# EAGLE design PCB-111000_V3 (EAGLE 9.6.2)
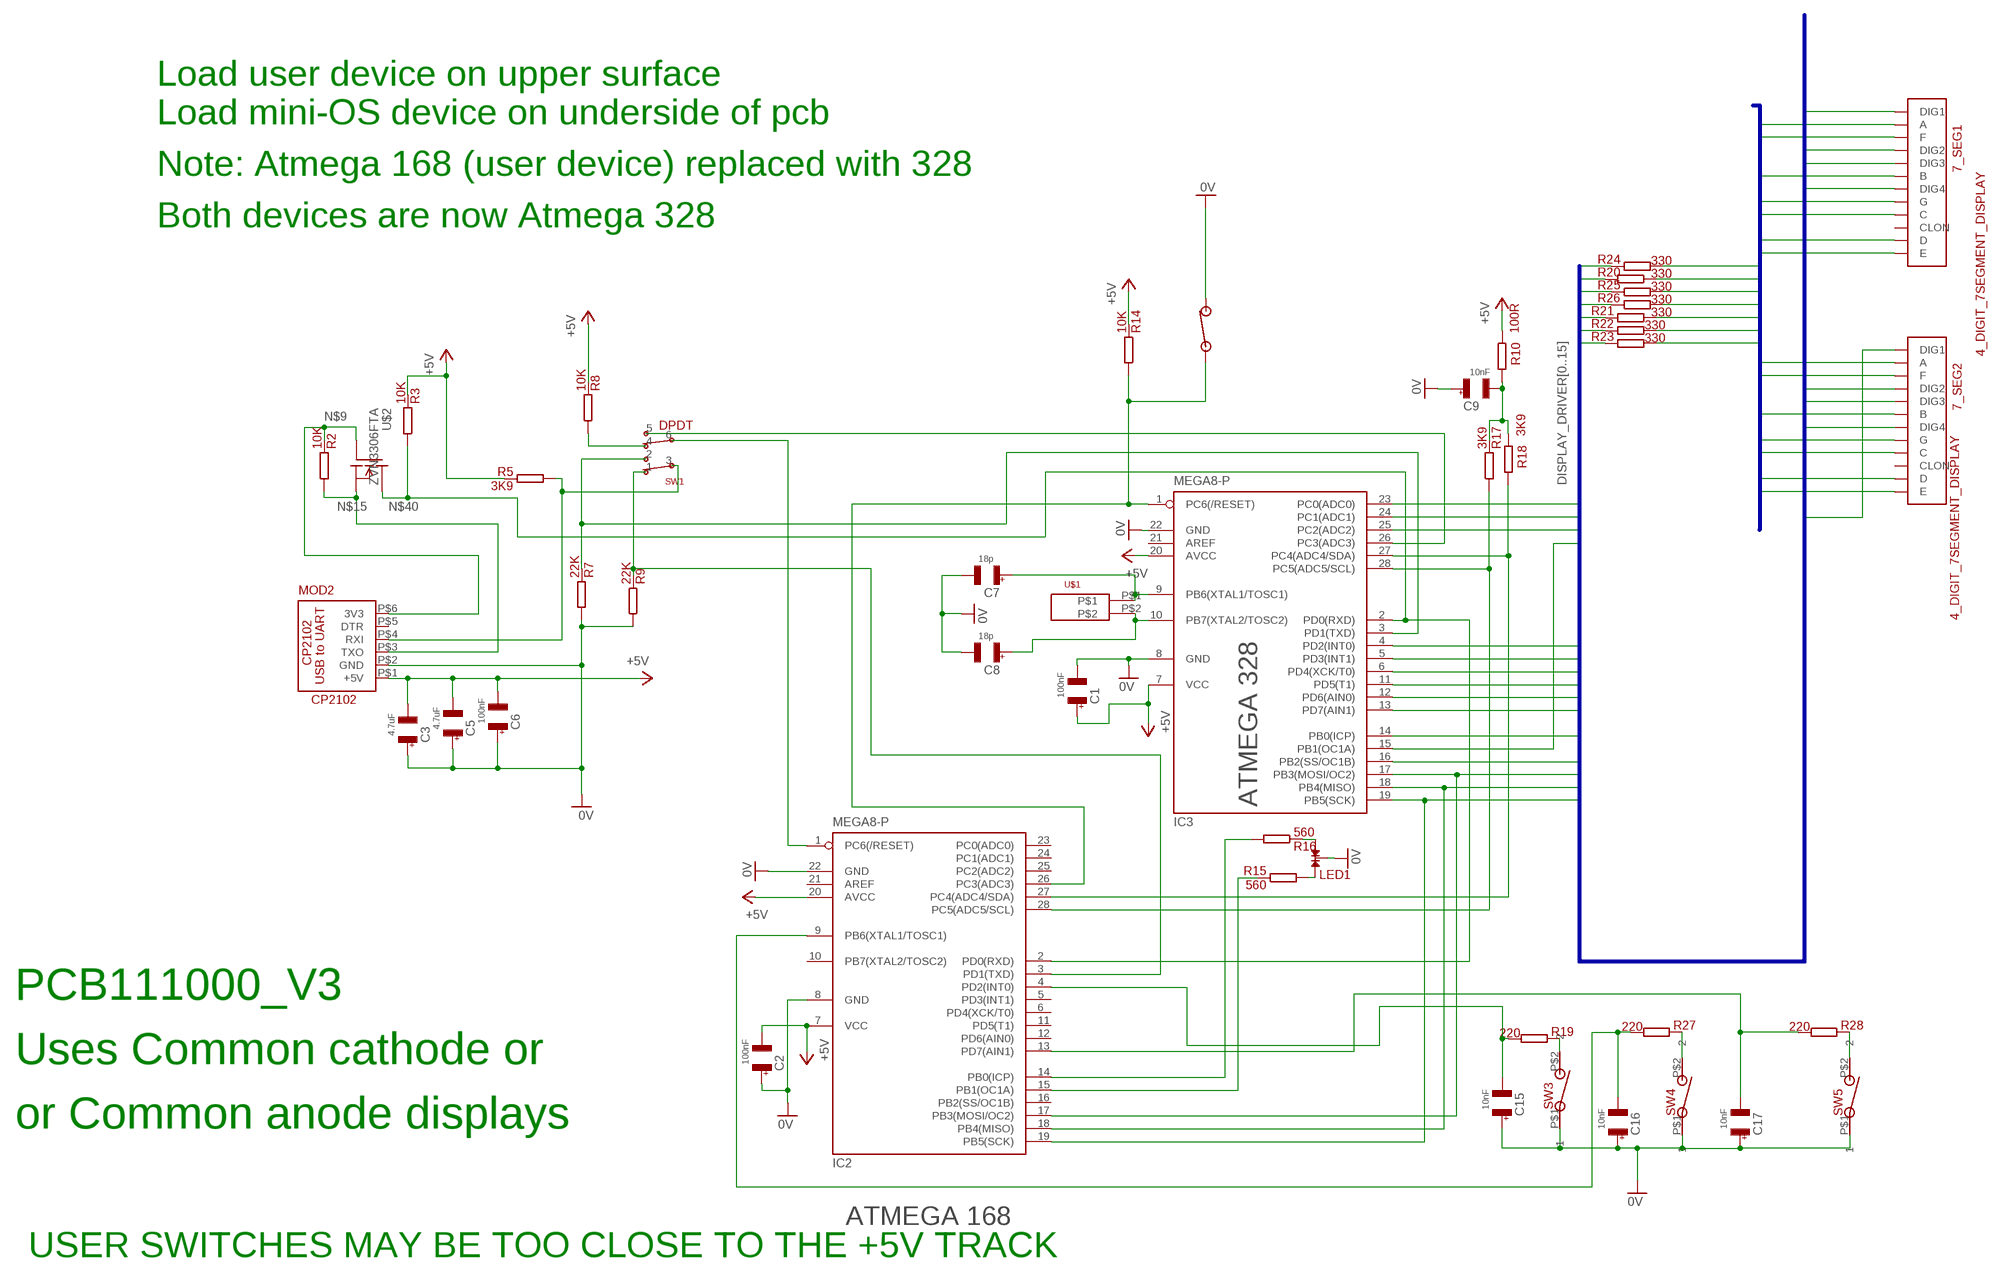
[diagram p0: schematic, sheet 1]

## Parts
7_SEG1  4_DIGIT_7SEGMENT_DISPLAY  [4_DIGIT_7SEGMENT_DISPLAY]
7_SEG2  4_DIGIT_7SEGMENT_DISPLAY  [4_DIGIT_7SEGMENT_DISPLAY]
C1  100nF  1206C  [1206@1]
C2  100nF  1206C  [1206@1]
C3  4.7uF  1206C  [1206@1]
C5  4.7uF  1206C  [1206@1]
C6  100nF  1206C  [1206@1]
C7  18p  0805C  [0805]
C8  18p  0805C  [0805]
C9  10nF  1206C  [1206@1]
C15  10nF  1206C  [1206@1]
C16  10nF  1206C  [1206@1]
C17  10nF  1206C  [1206@1]
IC2  MEGA8-P  [DIL28-3]
IC3  MEGA8-P  [DIL28-3]
LED1  LED  [CA_DUAL_LED]
MOD2  CP2102  [CP2102]
R2  10K  1206R  [1206]
R3  10K  1206R  [1206]
R5  3K9  1206R  [1206]
R7  22K  1206R  [1206]
R8  10K  1206R  [1206]
R9  22K  1206R  [1206]
R10  100R  1206R  [1206]
R14  10K  1206R  [1206]
R15  560  1206R  [1206]
R16  560  1206R  [1206]
R17  3K9  1206R  [1206]
R18  3K9  1206R  [1206]
R19  220  1206R  [1206]
R20  330  1206R  [1206]
R21  330  1206R  [1206]
R22  330  1206R  [1206]
R23  330  1206R  [1206]
R24  330  1206R  [1206]
R25  330  1206R  [1206]
R26  330  1206R  [1206]
R27  220  1206R  [1206]
R28  220  1206R  [1206]
SW1  DPDT  [DPDT_SWITCH]
SW2  NO_SW  [SM_NO_PUSH_BUTTON]
SW3  NO_PB_1  [RE51-0711]
SW4  NO_PB_1  [RE51-0711]
SW5  NO_PB_1  [RE51-0711]
U$1  XTAL  [XTAL_VIAS]
U$2  ZVN3306FTA  [SOT-23]

## Nets
0V: C1.P$2 C2.P$1 C3.P$1 C5.P$1 C6.P$1 C7.2 C8.2 C9.P$1 C15.P$1 C16.P$1 C17.P$1 IC2.8(GND) IC2.22(GND) IC3.8(GND) IC3.22(GND) LED1.2 MOD2.P$2(GND) R7.P$1 R9.P$1 SW2.P$2 SW3.P$1 SW4.P$1 SW5.P$1
+5V: C1.P$1 C2.P$2 C3.P$2 C5.P$2 C6.P$2 IC2.7(VCC) IC2.20(AVCC) IC3.7(VCC) IC3.20(AVCC) MOD2.P$1(+5V) R3.P$2 R5.P$2 R8.P$2 R10.P$2 R14.P$2
DISPLAY_DRIVER0: IC3.15(PB1(OC1A)) R24.P$2
DISPLAY_DRIVER1: IC3.4(PD2(INT0)) R20.P$2
DISPLAY_DRIVER2: IC3.5(PD3(INT1)) R25.P$2
DISPLAY_DRIVER3: IC3.6(PD4(XCK/T0)) R26.P$2
DISPLAY_DRIVER4: IC3.11(PD5(T1)) R21.P$2
DISPLAY_DRIVER5: IC3.12(PD6(AIN0)) R22.P$2
DISPLAY_DRIVER6: IC3.13(PD7(AIN1)) R23.P$2
DISPLAY_DRIVER8: 7_SEG2.P$12(DIG1) IC3.14(PB0(ICP))
DISPLAY_DRIVER9: 7_SEG2.P$9(DIG2) IC3.16(PB2(SS/OC1B))
DISPLAY_DRIVER10: 7_SEG2.P$8(DIG3) IC2.17(PB3(MOSI/OC2)) IC3.17(PB3(MOSI/OC2))
DISPLAY_DRIVER11: 7_SEG2.P$6(DIG4) IC2.18(PB4(MISO)) IC3.18(PB4(MISO))
DISPLAY_DRIVER12: 7_SEG1.P$12(DIG1) IC2.19(PB5(SCK)) IC3.19(PB5(SCK))
DISPLAY_DRIVER13: 7_SEG1.P$9(DIG2) IC3.23(PC0(ADC0))
DISPLAY_DRIVER14: 7_SEG1.P$8(DIG3) IC3.24(PC1(ADC1))
DISPLAY_DRIVER15: 7_SEG1.P$6(DIG4) IC3.25(PC2(ADC2))
N$1: IC2.14(PB0(ICP)) R16.P$1
N$2: IC2.15(PB1(OC1A)) R15.P$2
N$3: LED1.1 R15.P$1
N$4: LED1.3 R16.P$2
N$5: IC3.26(PC3(ADC3)) SW1.5
N$6: IC3.3(PD1(TXD)) R7.P$2 SW1.2
N$7: R27.P$2 SW4.P$2
N$8: R19.P$2 SW3.P$2
N$9: MOD2.P$6(3V3) R2.P$2 U$2.3(G)
N$10: C7.1 IC3.9(PB6(XTAL1/TOSC1)) U$1.P$1
N$11: C17.P$2 IC2.13(PD7(AIN1)) R28.P$1
N$12: C8.1 IC3.10(PB7(XTAL2/TOSC2)) U$1.P$2
N$13: R8.P$1 SW1.4
N$14: IC2.3(PD1(TXD)) R9.P$2 SW1.1
N$15: MOD2.P$3(TXO) R2.P$1 U$2.2(S)
N$16: R28.P$2 SW5.P$2
N$17: C15.P$2 IC2.4(PD2(INT0)) R19.P$1
N$19: C16.P$2 IC2.9(PB6(XTAL1/TOSC1)) R27.P$1
N$20: C9.P$2 R10.P$1 R17.P$2 R18.P$2
N$26: IC2.1(PC6(/RESET)) SW1.6
N$31: IC2.26(PC3(ADC3)) IC3.1(PC6(/RESET)) R14.P$1 SW2.P$1
N$35: MOD2.P$4(RXI) R5.P$1 SW1.3
N$38: IC2.28(PC5(ADC5/SCL)) IC3.28(PC5(ADC5/SCL)) R17.P$1
N$39: IC2.27(PC4(ADC4/SDA)) IC3.27(PC4(ADC4/SDA)) R18.P$1
N$40: IC2.2(PD0(RXD)) IC3.2(PD0(RXD)) R3.P$1 U$2.1(D)
SEVEN_SEG0: 7_SEG1.P$11(A) 7_SEG2.P$11(A) R24.P$1
SEVEN_SEG1: 7_SEG1.P$7(B) 7_SEG2.P$7(B) R20.P$1
SEVEN_SEG2: 7_SEG1.P$4(C) 7_SEG2.P$4(C) R25.P$1
SEVEN_SEG3: 7_SEG1.P$2(D) 7_SEG2.P$2(D) R26.P$1
SEVEN_SEG4: 7_SEG1.P$1(E) 7_SEG2.P$1(E) R21.P$1
SEVEN_SEG5: 7_SEG1.P$10(F) 7_SEG2.P$10(F) R22.P$1
SEVEN_SEG6: 7_SEG1.P$5(G) 7_SEG2.P$5(G) R23.P$1
Unconnected: 7_SEG1.P$3(CLON) 7_SEG2.P$3(CLON) IC2.5(PD3(INT1)) IC2.6(PD4(XCK/T0)) IC2.10(PB7(XTAL2/TOSC2)) IC2.11(PD5(T1)) IC2.12(PD6(AIN0)) IC2.16(PB2(SS/OC1B)) IC2.21(AREF) IC2.23(PC0(ADC0)) IC2.24(PC1(ADC1)) IC2.25(PC2(ADC2)) IC3.21(AREF) MOD2.P$5(DTR)

## Buses
SEVEN_SEG[0..7]
DISPLAY_DRIVER[0..15]

## Notes on the sheet
- Load user device on upper surface
- Load mini-OS device on underside of pcb
- Note: Atmega 168 (user device) replaced with 328
- Both devices are now Atmega 328
- ATMEGA 328
- PCB111000_V3
- Uses Common cathode or
- or Common anode displays
- ATMEGA 168
- USER SWITCHES MAY BE TOO CLOSE TO THE +5V TRACK

## Library data of the parts
7_SEG1 7_SEG2 = 1_marko:4_DIGIT_7SEGMENT_DISPLAY: Common Anode RE 55-1674
C1-C3 C5 C6 C9 C15-C17 = 1_Home_library:1206C: 4.7uF RS 538-2335 100nF RS 264-4179
C7 C8 = 1_3V3_Bootloader:0805C: 1uF RS 451-5770 10nF 264-4371 100nF 264-4416
IC2 IC3 = 1_Home_library:MEGA8-P: MICROCONTROLLER 8 Kbytes FLASH, 1 kbytes SRAM, 512 bytes EEPROM, USART, 4-channel 10 bit ADC, 2-channel 8 bit ADC Pin compatible with Atmega48, ATMega88, ATMega168 Source: avr.lbr; OC_FARNELL: unknown; OC_NEWARK: unknown
LED1 = 3_My_prog:LED: RS228-5770
MOD2 = home_library:CP2102
R2 R3 R5 R7-R10 R14-R28 = 1_Home_library:1206R
SW1 = 1_Home_library:DPDT: DPST switch RE 76-0100
SW2 = 1_Home_library:NO_SW: SM NO push button RE 51-0709
SW3-SW5 = 1_3V3_Bootloader:NO_PB_1: RE 51-0711
U$1 = 1_3V3_Bootloader:XTAL: Watch Crystal RS 478-9268
U$2 = mo:ZVN3306FTA

## Board
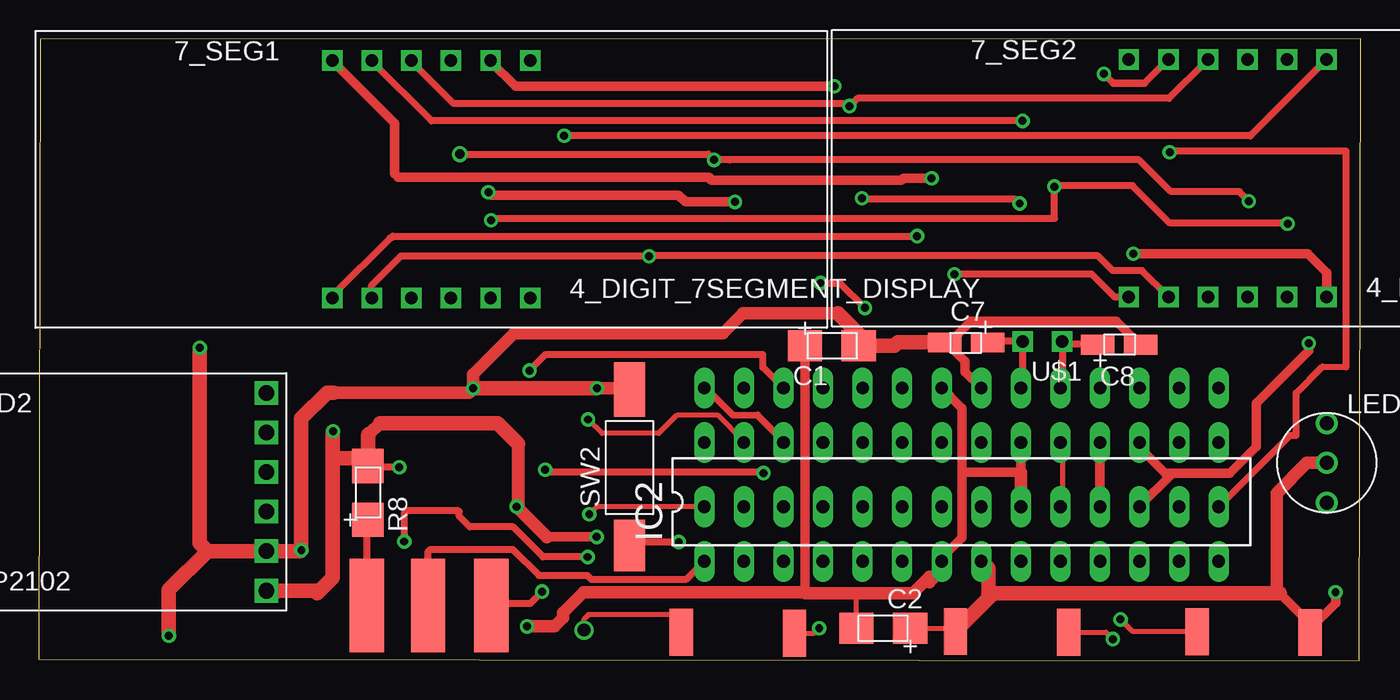
[diagram p1: board, top side]
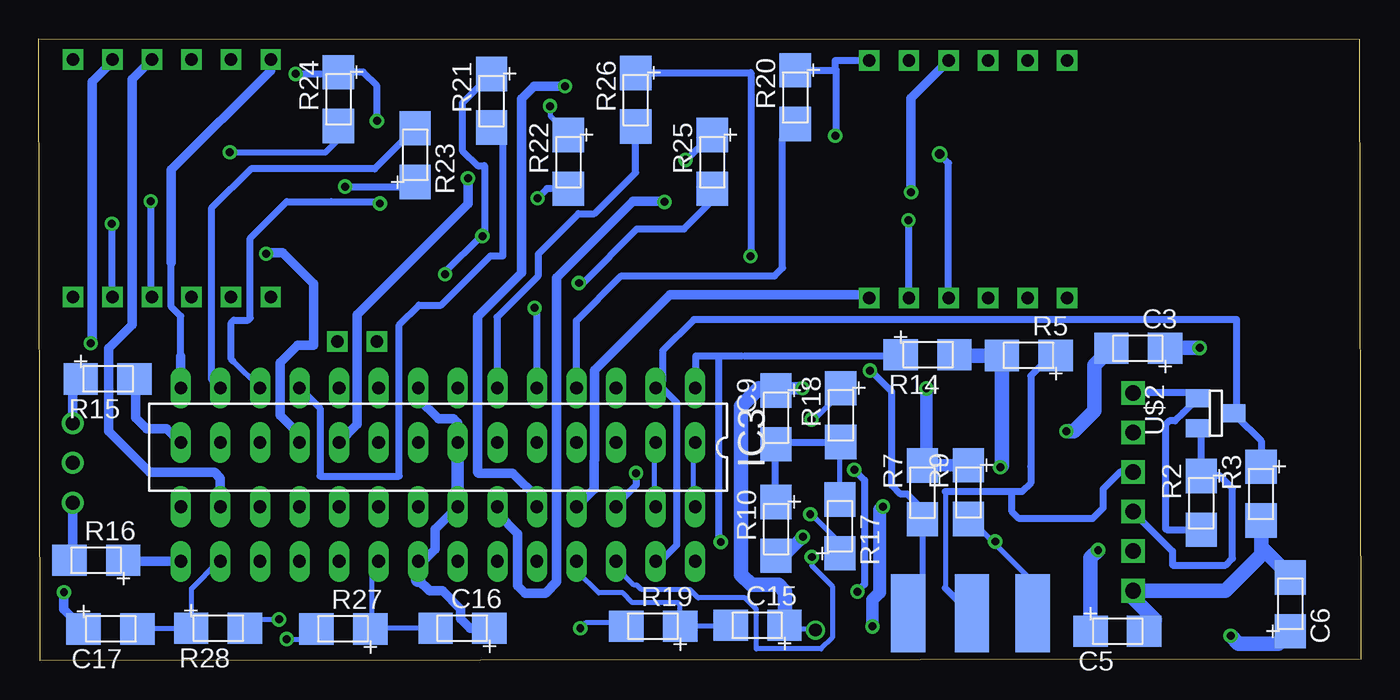
[diagram p2: board, bottom side, seen from below]

Size 84.83 x 39.89 mm. Coordinates in mm from the lower left corner, seen from the top.
Outline: 0,0.08 84.73,0 84.83,39.89 0.08,39.88 0,0.08
Copper layers (1*16): Top 0.035mm / dielectric 1.5mm / Bottom 0.035mm
Design rules "default *": minimum track width 12mil, minimum drill 20mil, track to track 8mil, track to pad 8mil, pad to pad 8mil, via to via 8mil, smd to smd 8mil, copper to edge 20mil, drill to drill 8mil, minimum pad ring 10mil, minimum via ring 8mil, stop-mask expansion 4mil, vias tented up to drill 0mil, thermal gap 10mil

### Footprints (pad centres in the part's own frame; a part is rotated, then mirrored left to right if it is on the bottom)
4_DIGIT_7SEGMENT_DISPLAY = drill 0.8 square: P$1 0,0; P$2 2.54,0; P$3 5.08,0; P$4 7.62,0; P$5 10.16,0; P$6 12.7,0; P$7 12.7,15.24; P$8 10.16,15.24; P$9 7.62,15.24; P$10 5.08,15.24; P$11 2.54,15.24; P$12 0,15.24
1206@1 = smd 2.2 x 2: P$1 -1.75,0; P$2 1.7,0
0805 = smd 2.159 x 1.27: 1 -1.404,0.1; 2 1.354,0.1
DIL28-3 = drill 0.813 long: 1 -16.51,-3.81; 2 -13.97,-3.81; 3 -11.43,-3.81; 4 -8.89,-3.81; 5 -6.35,-3.81; 6 -3.81,-3.81; 7 -1.27,-3.81; 8 1.27,-3.81; 9 3.81,-3.81; 10 6.35,-3.81; 11 8.89,-3.81; 12 11.43,-3.81; 13 13.97,-3.81; 14 16.51,-3.81; 15 16.51,3.81; 16 13.97,3.81; 17 11.43,3.81; 18 8.89,3.81; 19 6.35,3.81; 20 3.81,3.81; 21 1.27,3.81; 22 -1.27,3.81; 23 -3.81,3.81; 24 -6.35,3.81; 25 -8.89,3.81; 26 -11.43,3.81; 27 -13.97,3.81; 28 -16.51,3.81
CA_DUAL_LED = drill 0.9: 1 0,2.54; 2 0,0; 3 0,-2.54
CP2102 = drill 1 square: P$1 0,-5.08; P$2 0,-2.54; P$3 0,0; P$4 0,2.54; P$5 0,5.08; P$6 0,7.62
1206 = smd 2.2 x 2: P$1 -1.75,0; P$2 1.7,0
DPDT_SWITCH = smd 2.2 x 5: 1 -0.87,1.5; 2 7.13,1.5; 3 3.03,1.5 | smd 2.2 x 6 bottom: 4 -0.87,1; 5 7.13,1; 6 3.07,1
SM_NO_PUSH_BUTTON = smd 3.3 x 2: P$1 -2,1.5 | smd 3.5 x 2: P$2 8,1.5
RE51-0711 = smd 1.5 x 3: P$1 0.77,1.48; P$2 8.03,1.43
XTAL_VIAS = drill 0.8 square: P$1 0,1.27; P$2 0,-1.27
SOT-23 = smd 1.143 x 1.524: 1 0.025,-1.143; 2 -0.94,1.143; 3 0.991,1.143

### Placement (x,y rotation side)
7_SEG1  18.83,23.25 0 top
7_SEG2  69.96,23.33 0 top
C1  50.92,20.2 0 top
C2  54.17,2.07 180 top
C3  14.29,20.03 180 bottom
C5  15.59,1.88 0 bottom
C6  4.5,3.63 90 bottom
C7  59.49,20.52 180 top
C8  69.36,20.16 0 top
C9  37.52,15.58 270 bottom
C15  38.73,2.26 180 bottom
C16  57.66,2.08 180 bottom
C17  80.22,2.03 0 bottom
IC2  59.21,10.18 0 top
IC3  59.21,13.68 180 bottom
LED1  82.66,12.68 0 top
MOD2  14.61,9.56 0 top
R2  10.22,10.09 270 bottom
R3  6.38,10.69 270 bottom
R5  21.31,19.58 180 bottom
R7  28.12,10.77 270 bottom
R8  21.12,10.78 90 top
R9  25.16,10.78 270 bottom
R10  37.52,8.43 270 bottom
R14  27.77,19.63 0 bottom
R15  80.4,18.07 0 bottom
R16  81.16,6.43 180 bottom
R17  33.41,8.63 90 bottom
R18  33.37,15.73 270 bottom
R19  45.42,2.21 180 bottom
R20  36.28,36.12 270 bottom
R21  55.78,35.89 270 bottom
R22  50.85,31.97 270 bottom
R23  60.68,32.45 90 bottom
R24  65.6,36 270 bottom
R25  41.62,31.97 270 bottom
R26  46.52,35.96 270 bottom
R27  65.31,2.03 180 bottom
R28  73.31,2.08 0 bottom
SW1  21.91,4.53 180 bottom
SW2  39.41,9.38 90 top
SW3  40.46,0.33 0 top
SW4  58.05,0.39 0 top
SW5  82.37,3.28 180 top
U$1  64.41,20.48 90 top
U$2  9.29,15.84 90 bottom

### Tracks (layer width: path | path; a pad name or v marks a point on that pad's centre or on a via)
0V  (via drill 0.51, 0.81)
  Top 0.305: 70.6,20.34 C8.2 | 58.37,20.34 C7.2 | 37.89,17.48 SW2.P$2 | 41.23,1.92 41.16,2.96 35.3,2.96 34.99,2.66 v34.99,1.96 | 41.23,1.92 SW3.P$1 41.39,1.92 41.23,1.92 | C2.P$1 59.02,2.07 59.12,2.17
  Top 0.61: 70.6,20.34 69.15,21.78 59.82,21.78 58.37,20.34 | IC3.8 59.43,18.55 59.43,19.2 58.21,20.41 C7.2 | v83.22,4.38 83.22,3.67 81.55,2 81.59,1.95 SW5.P$1 81.59,2.38 81.26,2.71 79.44,4.52
  Top 0.813: v35.83,17.48 37.89,17.48 | 79.65,4.32 79.44,4.52 79.44,10.75 81.38,12.68 LED1.2 | 18.93,17.2 27.6,17.2 v27.87,17.46 27.87,18.36 30.5,20.99 43.91,20.99 45.2,22.27 51.27,22.27
  Top 0.914: IC2.8 60.95,5.91 60.95,4.19 61.15,4.19 | 79.65,4.32 61.28,4.32 61.15,4.19 | SW4.P$1 59.12,2.17 61.15,4.19 | v35.83,17.48 27.88,17.48 v27.87,17.46 | 51.27,22.27 52.62,20.92 C1.P$2 54.91,20.2 55.13,20.41 58.21,20.41 | v10.33,20.06 10.33,7.52 10.83,7.02 | v8.34,1.59 8.34,4.53 10.83,7.02 | 10.83,7.02 MOD2.P$2 16.77,7.02 v16.84,7.09 16.84,15.54 18.5,17.2 18.93,17.2
  Bottom 0.305: C16.P$1 55.99,2.08 | 37.58,17.32 C9.P$1 37.42,17.48 | 25.19,12.56 R9.P$1 | v34.99,1.96 35.06,2.03 36.74,2.03 C15.P$1 36.94,2.3
  Bottom 0.61: IC3.22 59.4,8.42 59.4,7.16 60.18,6.37 IC2.8 | IC2.22 57.95,15.24 58.21,15.5 59.19,15.5 60.48,16.8 IC3.8 | 55.99,2.08 57.17,2.08 57.76,2.67 57.76,3.29 58.94,4.47 59.76,4.47 60.48,5.19 | C17.P$1 83.22,3.29 v83.22,4.38
  Bottom 0.813: v35.83,17.48 37.42,17.48 37.58,17.32 | IC2.22 IC3.22 | 25.19,12.56 25.23,12.52 R7.P$1 27.87,12.78 v27.87,17.46
  Bottom 0.914: 37.42,17.48 38.61,17.48 39.76,16.33 39.76,5.5 39.1,4.85 37.37,4.85 36.94,4.42 36.94,2.3 | IC2.8 60.48,5.19 | v16.84,7.09 17.34,6.6 C5.P$1 | v10.33,20.06 12.52,20.06 C3.P$1 | C6.P$1 5.29,1.09 7.84,1.09 v8.34,1.59
+5V  (via drill 0.51)
  Top 0.305: C2.P$2 52.47,4.02 52.78,4.33
  Top 0.457: v23.13,12.4 21.2,12.4 R8.P$2
  Top 0.61: IC2.7 57.95,6.6 59.23,7.89 59.23,11.98 | 59.23,11.98 59.33,12.09 63.02,12.09 IC2.20 | IC3.7 59.23,16.2 59.23,11.98 | v35.8,7.93 32.6,7.93 | C1.P$1 49.17,18.65 49.16,18.63 49.16,4.37
  Top 0.813: 21.88,15.22 21.2,14.54 | IC2.7 57.95,5.83 57.15,5.03 57.15,5.37 56.1,4.33 52.78,4.33 49.2,4.33 49.16,4.37 34.95,4.37 33.66,3.07 33.66,2.75 33.09,2.19 v31.32,2.19 | 63.02,12.09 IC3.20
  Top 0.838: 32.6,7.93 v30.66,9.87 | v30.66,9.87 v30.66,9.88 | 30.75,13.92 30.75,9.96 v30.66,9.87
  Top 0.914: 21.88,15.22 29.45,15.22 30.75,13.92 | MOD2.P$1 17.7,4.48 17.84,4.34 18.84,5.32 18.84,12.98 | v18.88,14.71 18.84,14.67 18.84,12.98 | 18.84,12.98 20.61,12.98 R8.P$2 21.12,14.45 21.2,14.54
  Bottom 0.305: 23.13,19.54 R5.P$2 | 25.99,19.54 R14.P$2
  Bottom 0.457: MOD2.P$1
  Bottom 0.813: v31.32,2.19 31.32,3.89
  Bottom 0.838: 31.32,3.89 30.85,4.37 30.85,9.69 v30.66,9.88 | v35.8,7.93 37,6.73 R10.P$2
  Bottom 0.914: 25.99,19.54 23.13,19.54 | v23.13,12.4 23.02,12.52 R5.P$2 | R3.P$2 6.38,7.28 | 6.38,7.28 6.38,6.78 8.68,4.49 MOD2.P$1 | MOD2.P$1 14.61,4.02 13.2,2.61 13.2,2.57 C5.P$2 | C3.P$2 17.08,18.95 17.08,16.03 18.39,14.71 v18.88,14.71 | C6.P$2 4.5,5.4 6.38,7.28
DISPLAY_DRIVER0  (via drill 0.51)
  Top 0.381: 82.38,18.84 83.91,18.84 | 72.65,32.69 v72.57,32.61
  Top 0.457: IC3.15 80.31,14.45 80.69,14.45 80.69,17.16 82.38,18.84 | 83.91,18.84 83.91,32.69 72.65,32.69
  Bottom 0.381: v72.57,32.61 66.43,32.61 65.6,33.44 R24.P$2
DISPLAY_DRIVER1
  Bottom 0.305: 37.1,33.51 36.31,34.31 R20.P$2
  Bottom 0.457: 37.1,33.51 37.1,25.19 37.61,24.68 47.46,24.68 50.32,21.81 IC3.4
DISPLAY_DRIVER2  (via drill 0.51)
  Top 0.457: v50.18,24.23 51.41,24.23 v53.01,22.63
  Bottom 0.381: 52.87,22.48 v53.01,22.63
  Bottom 0.457: IC3.5 52.87,22.48 | v50.18,24.23 49.91,24.23 46.45,27.69 43.42,27.69 41.62,29.5 R25.P$2
DISPLAY_DRIVER3
  Bottom 0.457: IC3.6 55.4,21.99 55.44,22.03 52.77,24.7 52.77,26.09 50.2,28.67 49.17,28.67 46.52,31.31 R26.P$2
DISPLAY_DRIVER4
  Bottom 0.381: 55.04,34.19 R21.P$2
  Bottom 0.457: IC3.11 66.79,16.17 66.79,11.83 61.71,11.83 61.71,21.54 60.44,22.81 59.01,22.81 55.85,25.97 55.04,25.97 55.04,34.19
DISPLAY_DRIVER5  (via drill 0.51)
  Top 0.305: v52.83,29.66 52.83,29.61 | v62.95,29.33 62.66,29.61
  Top 0.457: 62.66,29.61 52.83,29.61
  Bottom 0.305: v62.95,29.33 63.07,29.45 | IC3.12 72.39,19.23
  Bottom 0.457: R22.P$2 52.22,30.27 v52.83,29.66 | 63.07,29.45 66.06,29.45 68.92,29.45 71.26,27.11 71.26,21.97 71.39,21.84 72.32,21.84 72.49,21.68 72.49,19.34 72.39,19.23
DISPLAY_DRIVER6
  Bottom 0.457: R23.P$2 63.27,31.55 71.22,31.55 73.76,29.01 73.76,18.06 IC3.13
DISPLAY_DRIVER8
  Bottom 0.457: 75.72,19.53 75.72,22.1 76.33,22.7 76.33,25.54
  Bottom 0.61: 7_SEG2.P$12 69.96,37.85 76.33,31.48 76.33,25.54 | IC3.14 75.72,19.53
DISPLAY_DRIVER9
  Bottom 0.61: IC3.16 73.19,11.7 73.56,12.07 77.73,12.07 80.37,14.71 80.37,20.05 78.86,21.55 78.86,37.28 7_SEG2.P$9
DISPLAY_DRIVER10  (via drill 0.51)
  Top 0.61: 72.77,12.03 76.43,12.03 78.13,13.73 78.13,16.49 81.51,19.87 v81.5,20.36 | 72.77,12.03 72.3,12.03 70.65,13.68 IC2.17 | 72.77,12.03 70.65,9.91 IC3.17
  Bottom 0.305: 80.12,38.44 7_SEG2.P$8
  Bottom 0.61: 80.12,38.44 81.4,37.15 81.4,20.45 v81.5,20.36
DISPLAY_DRIVER11  (via drill 0.51)
  Top 0.61: 7_SEG2.P$6 82.66,24.89 81.45,26.1 v70.25,26.1 | IC2.18 IC3.18
  Bottom 0.61: IC2.18 68.1,14.48 69.36,15.74 69.36,19.09 68.22,20.23 67.21,20.23 67.21,24.18 69.19,26.16 70.19,26.16 v70.25,26.1
DISPLAY_DRIVER12  (via drill 0.51)
  Top 0.305: IC3.19 65.68,10.02 65.68,13.99 IC2.19
  Top 0.61: 7_SEG1.P$12 22.83,34.49 22.83,31.22 23.04,31.02 43,31.02 43.18,30.83 55.37,30.83 55.48,30.95 v57.29,30.95
  Bottom 0.61: IC2.19 64.4,15.16 64.4,16.34 64.4,16.35 64.4,22.2 57.29,29.3 v57.29,30.95
DISPLAY_DRIVER13  (via drill 0.51)
  Top 0.61: v44.68,29.43 41.51,29.43 41.07,29.87 29.03,29.87 v28.85,30.05
  Bottom 0.61: v44.68,29.43 44.71,29.47 46.7,29.47 51.59,24.58 51.59,5.05 52.31,4.33 53.63,4.33 54.1,4.8 54.1,8.14 55.4,9.45 IC3.23 | 7_SEG1.P$9 28.85,36.09 v28.85,30.05
DISPLAY_DRIVER14  (via drill 0.51)
  Top 0.305: 29,38.44 7_SEG1.P$8
  Top 0.61: 29,38.44 30.59,36.85 v51.07,36.85
  Bottom 0.61: IC3.24 52.87,10.47 54.42,12.02 56.6,12.02 56.68,12.09 56.68,22.06 53.85,24.89 53.85,36.04 53.04,36.85 v51.07,36.85
DISPLAY_DRIVER15
  Bottom 0.61: IC3.25 49.2,10.99 49.2,12.8 49.16,12.85 49.16,18.64 44.33,23.46 31.74,23.46 7_SEG1.P$6
N$1
  Bottom 0.305: 79.33,6.37 R16.P$1 | 75.84,6.37 IC2.14
  Bottom 0.61: 75.84,6.37 79.33,6.37
N$2
  Bottom 0.305: 78.61,18 R15.P$2
  Bottom 0.61: IC2.15 76.62,14.88 77.92,14.88 78.61,15.58 78.61,18
N$3
  Bottom 0.61: R15.P$1 82.66,17.56 LED1.1
N$4
  Bottom 0.305: 82.66,6.68 82.82,6.53 R16.P$2 | 82.66,10.02 LED1.3
  Bottom 0.61: 82.66,10.02 82.66,6.68
N$5  (via drill 0.51)
  Top 0.305: 46.46,12.07 v46.5,12.03 | v32.5,12.24 32.67,12.07 | 29.16,3.67 SW1.5
  Top 0.457: 46.46,12.07 32.67,12.07 | v32.3,4.43 31.54,3.67 29.16,3.67
  Bottom 0.305: 47.74,10.02 IC3.26
  Bottom 0.457: 47.74,10.02 46.5,11.25 v46.5,12.03 | v32.5,12.24 31.84,11.59 31.84,4.89 v32.3,4.43
N$6  (via drill 0.51)
  Top 0.457: IC3.3 46.47,18.8 46.47,19.63 32.5,19.63 v31.49,18.62 v31.49,18.61
  Bottom 0.305: 29.16,3.03 SW1.2
  Bottom 0.381: R7.P$2 28.12,4.07 29.16,3.03
  Bottom 0.457: R7.P$2 28.12,9.7 29.09,10.67 29.52,10.67 30.08,11.23 30.08,17.26 31.43,18.61 v31.49,18.61
N$7  (via drill 0.51)
  Top 0.305: v68.94,1.38 68.49,1.82 SW4.P$2
  Bottom 0.305: R27.P$2 67.67,1.38 v68.94,1.38
N$8  (via drill 0.51)
  Top 0.305: v50.08,2.08 49.77,1.76 48.53,1.76 SW3.P$2
  Bottom 0.305: v50.08,2.08 49.71,2.46 47.37,2.46 R19.P$2
N$9
  Bottom 0.457: MOD2.P$6 10.79,17.18 U$2.3 11.36,15.9 11.38,15.9 11.91,15.38 12.28,15.38 12.52,15.14 12.52,8.45 12.46,8.39 R2.P$2
N$10
  Top 0.305: 60.91,20.5 C7.1 | 63.13,20.5 U$1.P$1 63.13,20.34 | 63.13,17.64 IC3.9
  Top 0.457: 63.13,20.5 60.91,20.5 | 63.13,20.34 63.13,17.64
N$11
  Bottom 0.305: C17.P$2 78.38,2.08 75.2,2.08 R28.P$1 75.04,2.08 75.04,4.62 73.29,6.37 IC2.13
N$12
  Top 0.305: 67.9,20.34 C8.1 | 65.83,20.34 U$1.P$2 65.68,20.34 | 65.68,17.64 IC3.10
  Top 0.457: 65.83,20.34 67.9,20.34 | 65.68,20.34 65.68,17.64
N$13
  Top 0.305: 21.07,8.91 R8.P$1 | 21.07,3.67 SW1.4
  Top 0.457: 21.07,3.67 21.07,8.91
N$14  (via drill 0.51)
  Top 0.457: v35.23,6.65 32.35,6.65 30.42,8.58 27.64,8.58 26.97,9.25 26.97,9.58 26.94,9.61 23.59,9.61 23.45,9.47 v23.45,7.64
  Bottom 0.305: 23.53,7.56 21.07,5.1 21.07,3.03 SW1.1 | 23.53,7.56 25.03,9.07 R9.P$2 | IC2.3 47.74,6.37 47.74,5.96 46.63,4.85 46.45,4.85 46.15,4.55 43.05,4.55 42.52,4.02 39.51,4.02 38.77,3.29 38.77,0.75 34.62,0.75 33.9,1.48 33.9,4.76 35.23,6.09 v35.23,6.65 | v23.45,7.64 23.53,7.56
N$15
  Bottom 0.457: U$2.2 10.22,14.69 R2.P$1 9.03,11.84 8.23,11.05 8.23,6.55 8.65,6.13 12.07,6.13 12.07,7.02 MOD2.P$3
N$16  (via drill 0.51)
  Top 0.305: SW5.P$2 70.22,1.85 v69.42,2.64
  Bottom 0.305: R28.P$2 71.05,2.64 v69.42,2.64
N$17
  Bottom 0.305: C15.P$2 40.42,2.24 43.6,2.24 R19.P$1 43.67,3.58 43.82,3.73 46.74,3.73 47.35,4.34 48.91,4.34 50.28,5.71 50.28,6.37 IC2.4
N$19
  Bottom 0.305: C16.P$2 59.48,2.08 63.45,2.08 R27.P$1 63.45,2.24 63.45,6.05 63.13,6.37 IC2.9
N$20
  Bottom 0.305: 37.58,10.34 R10.P$1 | 37.58,13.83 C9.P$2 37.42,13.99 | R17.P$2 33.45,10.34 33.45,13.99 R18.P$2 33.61,13.99
  Bottom 0.457: 37.58,13.83 37.58,10.34 | 33.61,13.99 37.42,13.99
N$26
  Top 0.457: SW1.6 24.98,7 25.12,7.14 30.41,7.14 32.09,5.46 35.19,5.46 35.43,5.23 41.56,5.23 IC2.1
N$31  (via drill 0.51)
  Top 0.305: 47.74,14.15 IC2.26 | 42.81,17.48 IC3.1 | 38.18,7.61 38.05,7.48 SW2.P$1
  Top 0.406: 44.54,15.75 46.13,15.75
  Top 0.457: 46.13,15.75 47.74,14.15 | 42.81,17.48 44.54,15.75 | v41.06,7.61 38.18,7.61
  Bottom 0.305: 40.27,19.54 39.71,19.54 39.54,19.54 | 29.64,19.54 R14.P$1 | 42.66,17.64 IC3.1 | 41.2,7.74 v41.06,7.61
  Bottom 0.457: 40.27,19.54 42.66,19.54 42.66,17.64 | 39.71,19.54 41.2,19.54 41.2,7.74 | 39.54,19.54 29.64,19.54
N$35
  Bottom 0.305: 25.03,3.03 SW1.3 | 26.65,10.84 26.65,4.65
  Bottom 0.457: 22.38,10.84 21.73,10.84 21.17,11.39 21.17,12.46 21.17,18.26 19.85,19.58 R5.P$1 | 22.38,10.84 26.65,10.84 | 26.65,4.65 25.03,3.03 | MOD2.P$4 15.43,12.1 16.54,10.99 16.54,9.78 17.21,9.11 21.92,9.11 22.38,9.56 22.38,10.84
N$38  (via drill 0.51)
  Top 0.305: v35.32,9.38 35.8,9.86 42.66,9.86 IC3.28
  Bottom 0.305: v35.32,9.38 35.24,9.38 33.67,7.82 R17.P$1 | IC2.28 42.81,13.99 42.81,10.02 IC3.28
N$39  (via drill 0.51)
  Top 0.305: v35.25,15.47 36.14,14.58 39.78,14.58 40.94,15.73 43.61,15.73 45.2,14.15 IC2.27
  Bottom 0.305: R18.P$1 33.37,17.19 35.09,15.47 v35.25,15.47 | IC3.27 45.35,10.02 45.35,13.99 IC2.27
N$40
  Bottom 0.457: IC2.2 44.94,6.37 43.91,7.4 43.91,16.56 44.83,17.49 IC3.2 44.79,17.95 44.79,19.88 42.79,21.88 7.97,21.88 7.97,15.68 | U$2.1 7.97,15.68 | 7.97,15.68 6.38,14.1 R3.P$1
SEVEN_SEG0  (via drill 0.51)
  Top 0.305: 72.34,38.44 7_SEG2.P$11 | 21.38,38.44 7_SEG1.P$11
  Top 0.457: 68.95,37.04 v68.35,37.64 | 72.34,38.44 70.94,37.04 | 21.38,38.44 25.19,34.62 v63.13,34.62
  Top 0.475: 70.94,37.04 68.95,37.04
  Bottom 0.457: v63.13,34.62 63.13,36.87 64.02,37.75 R24.P$1 65.72,37.64 v68.35,37.64
SEVEN_SEG1  (via drill 0.51)
  Top 0.457: 7_SEG2.P$7 77.76,33.67 v33.71,33.67
  Bottom 0.457: v33.71,33.67 33.68,33.71 33.68,37.96 33.73,38 | 7_SEG1.P$7 33.71,38.5 33.73,38.5 33.73,38 | R20.P$1 33.85,37.88 33.73,38
SEVEN_SEG2  (via drill 0.51, 0.61)
  Top 0.457: v77.66,29.47 77.05,30.08 74.47,30.08 72.65,30.08 70.61,32.12 44.33,32.12 v43.33,32.12 42.97,32.49 v27.02,32.49
  Bottom 0.305: 7_SEG2.P$4 77.66,23.42 | 41.7,33.67 R25.P$1
  Bottom 0.457: v77.66,29.47 77.66,23.42 | 7_SEG1.P$4 26.45,31.92 v27.02,32.49 | v43.33,32.12 43.25,32.12 41.7,33.67
SEVEN_SEG3  (via drill 0.51)
  Top 0.457: 7_SEG1.P$2 21.37,24.09 23.24,25.96 v39.16,25.96 | v39.16,25.96 v39.16,25.95 | v39.16,25.96 67.98,25.96 68.92,25.02 70.81,25.02 7_SEG2.P$2
  Bottom 0.457: R26.P$1 39.14,37.71 39.13,37.72 39.13,25.98 v39.16,25.95
SEVEN_SEG4  (via drill 0.51)
  Top 0.305: 18.85,23.42 7_SEG1.P$1
  Top 0.457: 18.85,23.42 22.54,27.11 22.6,27.11 22.73,27.23 v56.37,27.23 | 7_SEG2.P$1 69.04,23.33 67.57,24.8 58.76,24.8 v58.76,24.78
  Bottom 0.457: R21.P$1 57.65,35.77 57.65,32.72 56.69,31.75 56.24,31.75 56.24,27.36 v56.37,27.23 56.46,27.23 58.76,24.94 v58.76,24.78
SEVEN_SEG5  (via drill 0.51)
  Top 0.305: 74.88,38.44 7_SEG2.P$10 | 23.92,38.44 7_SEG1.P$10 | 52.02,35.74 v52.02,35.58
  Top 0.457: v52.02,35.58 52.52,36.08 72.53,36.08 74.88,38.44 | 23.92,38.44 26.62,35.74 52.02,35.74
  Bottom 0.305: v52.02,35.58 52.02,34.94 50.91,33.83 R22.P$1
SEVEN_SEG6  (via drill 0.51)
  Top 0.305: 65.19,28.35 65.18,28.36
  Top 0.381: v65.18,30.41 65.24,30.47
  Top 0.457: 65.18,28.36 v65.18,30.41 | 65.19,28.35 29.12,28.35 v29.02,28.25 | 65.24,30.47 70.19,30.47 72.59,28.07 80.12,28.07 v80.15,28.03
  Bottom 0.305: 61.17,30.41 R23.P$1
  Bottom 0.457: v65.18,30.41 61.17,30.41 | 7_SEG2.P$5 80.12,28 v80.15,28.03 | 7_SEG1.P$5 28.99,28.22 v29.02,28.25